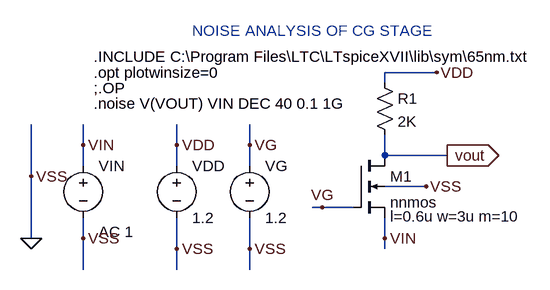
[diagram p0: schematic 11NOISE ANALYSIS OF CG STAGE.asc]
11NOISE ANALYSIS OF CG STAGE.asc, the LTspice schematic file:
Version 4
SHEET 1 880 680
WIRE 448 32 368 32
WIRE 368 48 368 32
WIRE -96 144 -96 112
WIRE 48 144 48 112
WIRE 160 144 160 112
WIRE 368 160 368 128
WIRE 464 160 368 160
WIRE -96 176 -96 144
WIRE 48 176 48 144
WIRE 160 176 160 144
WIRE -176 192 -176 112
WIRE 432 208 368 208
WIRE 272 240 256 240
WIRE 320 240 272 240
WIRE -176 288 -176 192
WIRE -96 288 -96 256
WIRE 368 288 368 256
WIRE 48 304 48 256
WIRE 160 304 160 256
WIRE 368 304 368 288
WIRE -96 336 -96 288
WIRE 48 336 48 304
WIRE 160 336 160 304
FLAG 464 160 vout
IOPIN 464 160 Out
FLAG -176 288 0
FLAG -176 192 VSS
FLAG -96 288 VSS
FLAG 48 304 VSS
FLAG 432 208 VSS
FLAG 48 144 VDD
FLAG 448 32 VDD
FLAG -96 144 VIN
FLAG 160 304 VSS
FLAG 160 144 VG
FLAG 272 240 VG
FLAG 368 288 VIN
SYMBOL nmos4 320 160 R0
WINDOW 123 56 94 Left 2
SYMATTR Value2 l=0.6u w=3u m=10
SYMATTR InstName M1
SYMATTR Value nnmos
SYMBOL res 352 32 R0
SYMATTR InstName R1
SYMATTR Value 2K
SYMBOL voltage 48 160 R0
SYMATTR InstName VDD
SYMATTR Value 1.2
SYMBOL voltage -96 160 R0
WINDOW 123 24 118 Left 2
WINDOW 39 0 0 Left 0
SYMATTR Value2 AC 1
SYMATTR InstName VIN
SYMATTR Value ""
SYMBOL voltage 160 160 R0
SYMATTR InstName VG
SYMATTR Value 1.2
TEXT -80 8 Left 2 !.INCLUDE C:\\Program Files\\LTC\\LTspiceXVII\\lib\\sym\\65nm.txt
TEXT -80 32 Left 2 !.opt plotwinsize=0
TEXT -80 56 Left 2 !;.OP
TEXT -80 80 Left 2 !.noise V(VOUT) VIN DEC 40 0.1 1G
TEXT 72 -32 Left 2 ;NOISE ANALYSIS OF CG STAGE

The netlist it stands for:
* 11NOISE ANALYSIS OF CG STAGE.asc
M1 vout VG VIN 0 nnmos l=0.6u w=3u m=10
R1 VDD vout 2K
VDD VDD 0 1.2
VIN VIN 0 AC 1
VG VG 0 1.2
.model NMOS NMOS
.model PMOS PMOS
.lib standard.mos
.INCLUDE C:\Program Files\LTC\LTspiceXVII\lib\sym\65nm.txt
.opt plotwinsize=0
;.OP
.noise V(VOUT) VIN DEC 40 0.1 1G
* NOISE ANALYSIS OF CG STAGE
.backanno
.end